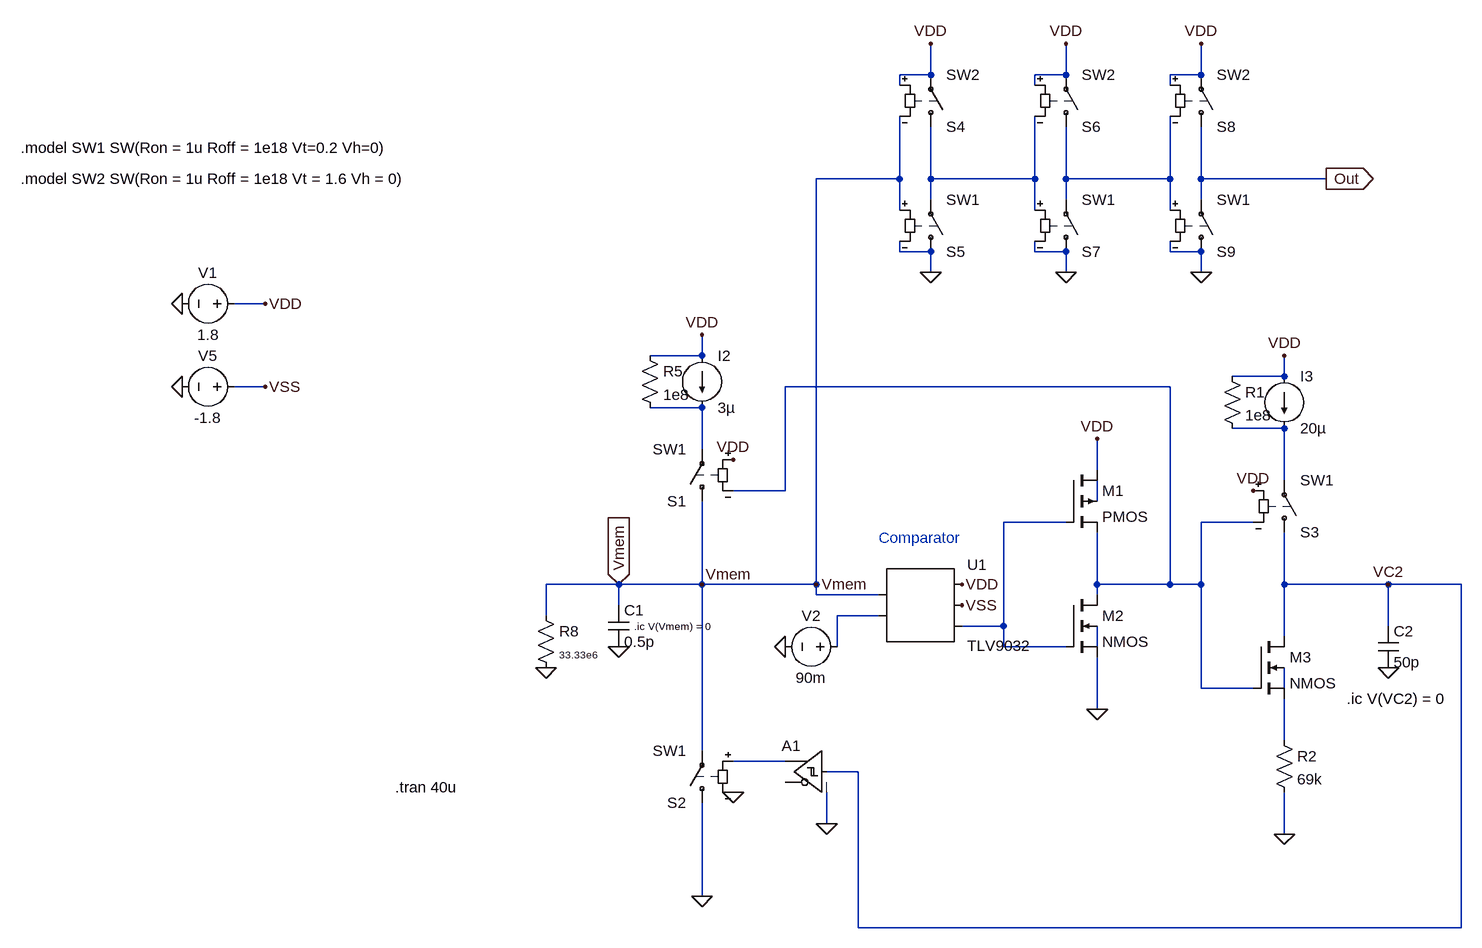
[diagram p0: schematic LIFtest.asc]
LIFtest.asc, the LTspice schematic file:
Version 4
SHEET 1 1828 976
WIRE 704 -736 704 -784
WIRE 704 -736 656 -736
WIRE 912 -736 912 -784
WIRE 912 -736 864 -736
WIRE 1120 -736 1120 -784
WIRE 1120 -736 1072 -736
WIRE 656 -720 656 -736
WIRE 864 -720 864 -736
WIRE 1072 -720 1072 -736
WIRE 656 -576 656 -672
WIRE 656 -576 528 -576
WIRE 704 -576 704 -656
WIRE 864 -576 864 -672
WIRE 864 -576 704 -576
WIRE 912 -576 912 -656
WIRE 1072 -576 1072 -672
WIRE 1072 -576 912 -576
WIRE 1120 -576 1120 -656
WIRE 1312 -576 1120 -576
WIRE 704 -544 704 -576
WIRE 912 -544 912 -576
WIRE 1120 -544 1120 -576
WIRE 656 -528 656 -576
WIRE 864 -528 864 -576
WIRE 1072 -528 1072 -576
WIRE 656 -464 656 -480
WIRE 704 -464 656 -464
WIRE 864 -464 864 -480
WIRE 912 -464 864 -464
WIRE 1072 -464 1072 -480
WIRE 1120 -464 1072 -464
WIRE 704 -432 704 -464
WIRE 912 -432 912 -464
WIRE 1120 -432 1120 -464
WIRE -320 -384 -368 -384
WIRE 352 -304 352 -336
WIRE 352 -304 272 -304
WIRE 1248 -272 1248 -304
WIRE 1248 -272 1168 -272
WIRE -320 -256 -368 -256
WIRE 1072 -256 480 -256
WIRE 352 -224 272 -224
WIRE 1248 -192 1168 -192
WIRE 352 -160 352 -224
WIRE 960 -128 960 -176
WIRE 1248 -112 1248 -192
WIRE 480 -96 480 -256
WIRE 480 -96 400 -96
WIRE 960 -80 960 -112
WIRE 912 -48 816 -48
WIRE 1200 -48 1120 -48
WIRE 224 48 112 48
WIRE 352 48 352 -80
WIRE 352 48 224 48
WIRE 528 48 528 -576
WIRE 528 48 352 48
WIRE 960 48 960 -32
WIRE 1072 48 1072 -256
WIRE 1072 48 960 48
WIRE 1120 48 1120 -48
WIRE 1120 48 1072 48
WIRE 1248 48 1248 -32
WIRE 1408 48 1248 48
WIRE 1520 48 1408 48
WIRE 528 64 528 48
WIRE 624 64 528 64
WIRE 960 64 960 48
WIRE 224 80 224 48
WIRE 112 96 112 48
WIRE 624 96 560 96
WIRE 816 112 816 -48
WIRE 816 112 752 112
WIRE 1408 112 1408 48
WIRE 1248 128 1248 48
WIRE 560 144 560 96
WIRE 816 144 816 112
WIRE 912 144 816 144
WIRE 960 144 960 112
WIRE 1120 208 1120 48
WIRE 1200 208 1120 208
WIRE 1248 208 1248 176
WIRE 960 240 960 160
WIRE 1248 288 1248 224
WIRE 352 304 352 48
WIRE 480 320 400 320
WIRE 592 336 544 336
WIRE 544 416 544 368
WIRE 1248 432 1248 368
WIRE 352 528 352 384
WIRE 592 576 592 336
WIRE 1520 576 1520 48
WIRE 1520 576 592 576
FLAG 224 144 0
FLAG 352 528 0
FLAG 352 -336 VDD
FLAG -448 -384 0
FLAG -320 -384 VDD
FLAG 112 176 0
FLAG 224 48 Vmem
IOPIN 224 48 In
FLAG 400 368 0
FLAG 400 -144 VDD
FLAG 480 144 0
FLAG 960 240 0
FLAG 960 -176 VDD
FLAG 1200 -96 VDD
FLAG 1248 -304 VDD
FLAG 1248 432 0
FLAG 1408 176 0
FLAG 1408 48 VC2
FLAG 544 416 0
FLAG -448 -256 0
FLAG -320 -256 VSS
FLAG 752 48 VDD
FLAG 752 80 VSS
FLAG 352 48 Vmem
FLAG 528 48 Vmem
FLAG 704 -784 VDD
FLAG 704 -432 0
FLAG 912 -784 VDD
FLAG 912 -432 0
FLAG 1120 -784 VDD
FLAG 1120 -432 0
FLAG 1312 -576 Out
IOPIN 1312 -576 Out
SYMBOL cap 208 80 R0
SYMATTR InstName C1
SYMATTR Value 0.5p
SYMBOL current 352 -304 R0
WINDOW 123 0 0 Left 0
WINDOW 39 0 0 Left 0
SYMATTR InstName I2
SYMATTR Value 3µ
SYMBOL voltage -352 -384 R90
WINDOW 0 -32 56 VBottom 2
WINDOW 3 32 56 VTop 2
WINDOW 123 0 0 Left 0
WINDOW 39 0 0 Left 0
SYMATTR InstName V1
SYMATTR Value 1.8
SYMBOL res 256 -320 R0
SYMATTR InstName R5
SYMATTR Value 1e8
SYMBOL res 96 80 R0
WINDOW 3 36 76 Left 1
SYMATTR Value 33.33e6
SYMATTR InstName R8
SYMBOL sw 352 400 R180
SYMATTR InstName S2
SYMATTR Value SW1
SYMBOL sw 352 -64 R180
SYMATTR InstName S1
SYMATTR Value SW1
SYMBOL voltage 576 144 M270
WINDOW 0 32 56 VTop 2
WINDOW 3 -32 56 VBottom 2
WINDOW 123 0 0 Left 0
WINDOW 39 0 0 Left 0
SYMATTR InstName V2
SYMATTR Value 90m
SYMBOL pmos4 912 -128 R0
SYMATTR InstName M1
SYMBOL nmos4 912 64 R0
SYMATTR InstName M2
SYMBOL sw 1248 -16 M180
SYMATTR InstName S3
SYMATTR Value SW1
SYMBOL current 1248 -272 R0
WINDOW 123 0 0 Left 0
WINDOW 39 0 0 Left 0
SYMATTR InstName I3
SYMATTR Value 20µ
SYMBOL res 1152 -288 R0
SYMATTR InstName R1
SYMATTR Value 1e8
SYMBOL cap 1392 112 R0
SYMATTR InstName C2
SYMATTR Value 50p
SYMBOL res 1232 272 R0
SYMATTR InstName R2
SYMATTR Value 69k
SYMBOL Digital\\schmitt 544 272 M0
WINDOW 3 0 0 Invisible 0
SYMATTR Value Vhigh=1.8 Vt=100m Vh=60m Trise=1n Tfall=1n
SYMATTR InstName A1
SYMBOL voltage -352 -256 R90
WINDOW 0 -32 56 VBottom 2
WINDOW 3 32 56 VTop 2
WINDOW 123 0 0 Left 0
WINDOW 39 0 0 Left 0
SYMATTR InstName V5
SYMATTR Value -1.8
SYMBOL AutoGenerated\\TLV9032 688 80 R0
SYMATTR InstName U1
SYMBOL nmos4 1200 128 R0
SYMATTR InstName M3
SYMBOL sw 704 -640 M180
SYMATTR InstName S4
SYMATTR Value SW2
SYMBOL sw 704 -448 M180
SYMATTR InstName S5
SYMATTR Value SW1
SYMBOL sw 912 -640 M180
SYMATTR InstName S6
SYMATTR Value SW2
SYMBOL sw 912 -448 M180
SYMATTR InstName S7
SYMATTR Value SW1
SYMBOL sw 1120 -640 M180
SYMATTR InstName S8
SYMATTR Value SW2
SYMBOL sw 1120 -448 M180
SYMATTR InstName S9
SYMATTR Value SW1
TEXT -120 360 Left 2 !.tran 40u
TEXT 248 112 Left 1 !.ic V(Vmem) = 0
TEXT -696 -624 Left 2 !.model SW1 SW(Ron = 1u Roff = 1e18 Vt=0.2 Vh=0)
TEXT -696 -576 Left 2 !.model SW2 SW(Ron = 1u Roff = 1e18 Vt = 1.6 Vh = 0)
TEXT 1344 224 Left 2 !.ic V(VC2) = 0
TEXT 624 -24 Left 2 ;Comparator

The netlist it stands for:
* LIFtest.asc
C1 Vmem 0 0.5p
I2 VDD N004 3µ
V1 VDD 0 1.8
R5 VDD N004 1e8
R8 Vmem 0 33.33e6
S2 0 Vmem N012 0 SW1
S1 Vmem N004 VDD N003 SW1
V2 N008 0 90m
M1 VDD N007 N003 N006 PMOS
M2 N003 N007 0 N009 NMOS
S3 VC2 N005 VDD N003 SW1
I3 VDD N005 20µ
R1 VDD N005 1e8
C2 VC2 0 50p
R2 N011 0 69k
A1 VC2 0 0 0 0 0 N012 0 SCHMITT Vhigh=1.8 Vt=100m Vh=60m Trise=1n Tfall=1n
V5 VSS 0 -1.8
* U1: TLV9032 (symbol AutoGenerated\TLV9032 not available, pins judged from their places): pin1=Vmem pin2=N008 pin3=VDD pin4=VSS pin5=N007
M3 VC2 N003 N011 N010 NMOS
S4 N001 VDD VDD Vmem SW2
S5 0 N001 Vmem 0 SW1
S6 N002 VDD VDD N001 SW2
S7 0 N002 N001 0 SW1
S8 Out VDD VDD N002 SW2
S9 0 Out N002 0 SW1
.model NMOS NMOS
.model PMOS PMOS
.lib standard.mos
.tran 40u
.ic V(Vmem) = 0
.model SW1 SW(Ron = 1u Roff = 1e18 Vt=0.2 Vh=0)
.model SW2 SW(Ron = 1u Roff = 1e18 Vt = 1.6 Vh = 0)
.ic V(VC2) = 0
* Comparator
.backanno
.end